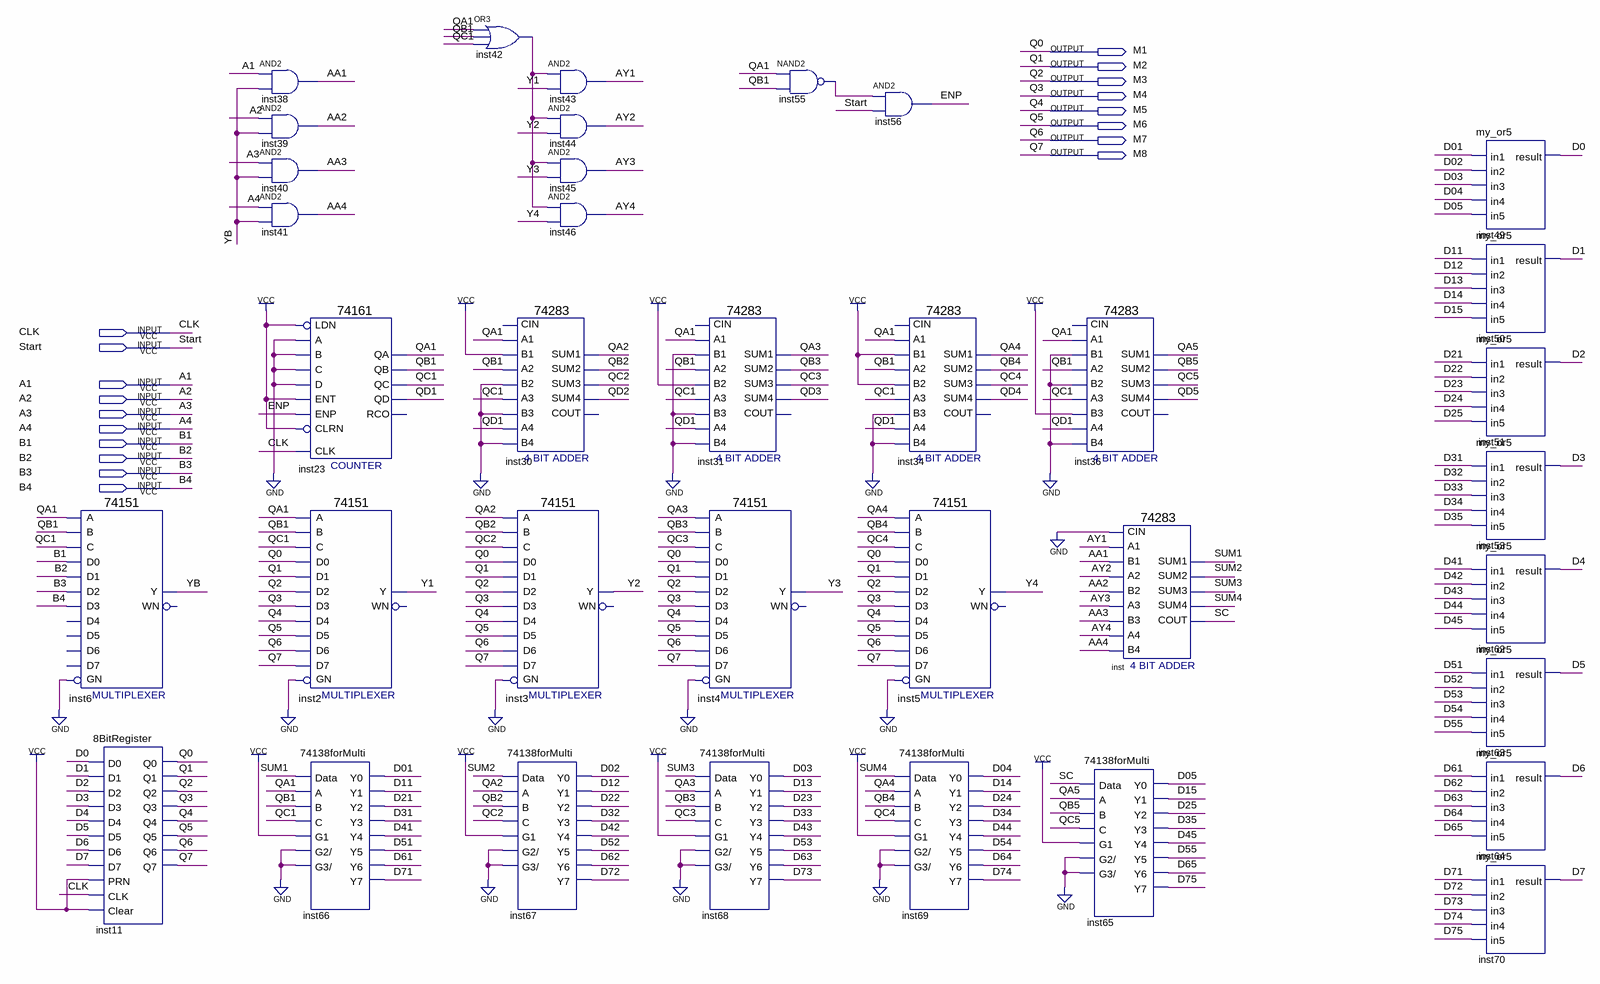
[diagram p0: schematic sheet]
// Quartus schematic 4BitMulti.bdf as structural Verilog: 36 symbols, 18 pins
module \4BitMulti  (
  input  CLK,
  input  Start,
  input  A1,
  input  A2,
  input  A3,
  input  A4,
  input  B1,
  input  B2,
  input  B3,
  input  B4,
  output M1,
  output M2,
  output M3,
  output M4,
  output M5,
  output M6,
  output M7,
  output M8
);

  wire AA1, AA2, AA3, AA4, AY1, AY2, AY3, AY4, D0, D01, D1, D2, D02, D03, D3, D04, D4, D5, D05, D6, D7, D11,
       D12, D13, D14, D15, D21, D22, D23, D24, D25, D31, D32, D33, D34, D35, D41, D42, D43, D44, D45, D51,
       D52, D53, D54, D55, D61, D62, D63, D64, D65, D71, D72, D73, D74, D75, ENP, inst42_out, inst55_out,
       QA1, QA2, QA3, QA4, QA5, QB1, QB2, QB3, QB4, QB5, QC1, QC2, QC3, QC4, QC5, QD1, QD2, QD3, QD4, QD5,
       SC, SUM1, SUM2, SUM3, SUM4, Y1, Y2, Y3, Y4, YB;

  \74151  inst6 (
    .GN(1'b0), .C(QC1), .B(QB1), .A(QA1), .D0(B1), .D1(B2), .D3(B4), .D2(B3), .Y(YB));  // open: D5, D4, D6, D7, WN
  \8BitRegister  inst11 (
    .D0(D0), .D1(D1), .D2(D2), .D3(D3), .D4(D4), .D5(D5), .D6(D6), .D7(D7), .PRN(1'b1), .CLK(CLK),
    .Clear(1'b1), .Q0(M1), .Q1(M2), .Q2(M3), .Q3(M4), .Q4(M5), .Q5(M6), .Q6(M7), .Q7(M8));
  and inst38 (AA1, A1, YB);
  and inst39 (AA2, A2, YB);
  and inst40 (AA3, A3, YB);
  and inst41 (AA4, A4, YB);
  \74161  inst23 (
    .CLRN(1'b1), .CLK(CLK), .ENP(ENP), .LDN(1'b1), .A(1'b0), .D(1'b0), .ENT(1'b1), .B(1'b0), .C(1'b0),
    .QD(QD1), .QC(QC1), .QB(QB1), .QA(QA1));  // open: RCO
  \74151  inst2 (
    .GN(1'b0), .C(QC1), .B(QB1), .A(QA1), .D5(M6), .D0(M1), .D1(M2), .D4(M5), .D3(M4), .D2(M3), .D6(M7),
    .D7(M8), .Y(Y1));  // open: WN
  \74138forMulti  inst66 (
    .Data(SUM1), .A(QA1), .B(QB1), .C(QC1), .G1(1'b1), .\G2/ (1'b0), .\G3/ (1'b0), .Y0(D01), .Y1(D11),
    .Y2(D21), .Y3(D31), .Y4(D41), .Y5(D51), .Y6(D61), .Y7(D71));
  or inst42 (inst42_out, QA1, QB1, QC1);
  \74283  inst30 (
    .A1(QA1), .A2(QB1), .B2(1'b0), .A3(QC1), .A4(QD1), .B4(1'b0), .B1(1'b1), .B3(1'b0), .SUM4(QD2),
    .SUM1(QA2), .SUM2(QB2), .SUM3(QC2));  // open: CIN, COUT
  \74151  inst3 (
    .GN(1'b0), .C(QC2), .B(QB2), .A(QA2), .D5(M6), .D0(M1), .D1(M2), .D4(M5), .D3(M4), .D2(M3), .D6(M7),
    .D7(M8), .Y(Y2));  // open: WN
  \74138forMulti  inst67 (
    .Data(SUM2), .A(QA2), .B(QB2), .C(QC2), .G1(1'b1), .\G2/ (1'b0), .\G3/ (1'b0), .Y0(D02), .Y1(D12),
    .Y2(D22), .Y3(D32), .Y4(D42), .Y5(D52), .Y6(D62), .Y7(D72));
  and inst43 (AY1, inst42_out, Y1);
  and inst44 (AY2, inst42_out, Y2);
  and inst45 (AY3, inst42_out, Y3);
  and inst46 (AY4, inst42_out, Y4);
  \74283  inst31 (
    .A1(QA1), .A2(QB1), .B2(1'b1), .A3(QC1), .A4(QD1), .B4(1'b0), .B1(1'b0), .B3(1'b0), .SUM4(QD3),
    .SUM1(QA3), .SUM2(QB3), .SUM3(QC3));  // open: CIN, COUT
  \74151  inst4 (
    .GN(1'b0), .C(QC3), .B(QB3), .A(QA3), .D5(M6), .D0(M1), .D1(M2), .D4(M5), .D3(M4), .D2(M3), .D6(M7),
    .D7(M8), .Y(Y3));  // open: WN
  \74138forMulti  inst68 (
    .Data(SUM3), .A(QA3), .B(QB3), .C(QC3), .G1(1'b1), .\G2/ (1'b0), .\G3/ (1'b0), .Y0(D03), .Y1(D13),
    .Y2(D23), .Y3(D33), .Y4(D43), .Y5(D53), .Y6(D63), .Y7(D73));
  nand inst55 (inst55_out, QA1, QB1);
  and inst56 (ENP, inst55_out, Start);
  \74283  inst34 (
    .A1(QA1), .A2(QB1), .B2(1'b1), .A3(QC1), .A4(QD1), .B4(1'b0), .B1(1'b1), .B3(1'b0), .SUM4(QD4),
    .SUM1(QA4), .SUM2(QB4), .SUM3(QC4));  // open: CIN, COUT
  \74151  inst5 (
    .GN(1'b0), .C(QC4), .B(QB4), .A(QA4), .D5(M6), .D0(M1), .D1(M2), .D4(M5), .D3(M4), .D2(M3), .D6(M7),
    .D7(M8), .Y(Y4));  // open: WN
  \74138forMulti  inst69 (
    .Data(SUM4), .A(QA4), .B(QB4), .C(QC4), .G1(1'b1), .\G2/ (1'b0), .\G3/ (1'b0), .Y0(D04), .Y1(D14),
    .Y2(D24), .Y3(D34), .Y4(D44), .Y5(D54), .Y6(D64), .Y7(D74));
  \74283  inst36 (
    .A1(QA1), .A2(QB1), .B2(1'b0), .A3(QC1), .A4(QD1), .B4(1'b0), .B1(1'b0), .B3(1'b1), .SUM4(QD5),
    .SUM1(QA5), .SUM2(QB5), .SUM3(QC5));  // open: CIN, COUT
  \74283  inst (
    .CIN(1'b0), .A1(AY1), .A2(AY2), .B2(AA2), .A3(AY3), .A4(AY4), .B4(AA4), .B1(AA1), .B3(AA3), .SUM4(SUM4),
    .COUT(SC), .SUM1(SUM1), .SUM2(SUM2), .SUM3(SUM3));
  \74138forMulti  inst65 (
    .Data(SC), .A(QA5), .B(QB5), .C(QC5), .G1(1'b1), .\G2/ (1'b0), .\G3/ (1'b0), .Y0(D05), .Y1(D15),
    .Y2(D25), .Y3(D35), .Y4(D45), .Y5(D55), .Y6(D65), .Y7(D75));
  my_or5 inst49 (.in1(D01), .in2(D02), .in3(D03), .in4(D04), .in5(D05), .result(D0));
  my_or5 inst50 (.in1(D11), .in2(D12), .in3(D13), .in4(D14), .in5(D15), .result(D1));
  my_or5 inst51 (.in1(D21), .in2(D22), .in3(D23), .in4(D24), .in5(D25), .result(D2));
  my_or5 inst53 (.in1(D31), .in2(D32), .in3(D33), .in4(D34), .in5(D35), .result(D3));
  my_or5 inst62 (.in1(D41), .in2(D42), .in3(D43), .in4(D44), .in5(D45), .result(D4));
  my_or5 inst63 (.in1(D51), .in2(D52), .in3(D53), .in4(D54), .in5(D55), .result(D5));
  my_or5 inst64 (.in1(D61), .in2(D62), .in3(D63), .in4(D64), .in5(D65), .result(D6));
  my_or5 inst70 (.in1(D71), .in2(D72), .in3(D73), .in4(D74), .in5(D75), .result(D7));

  // Other names for the same wires on the sheet: Q0 = M1; Q1 = M2; Q2 = M3; Q3 = M4; Q4 = M5; Q5 = M6; Q6 = M7;
  //   Q7 = M8
endmodule
